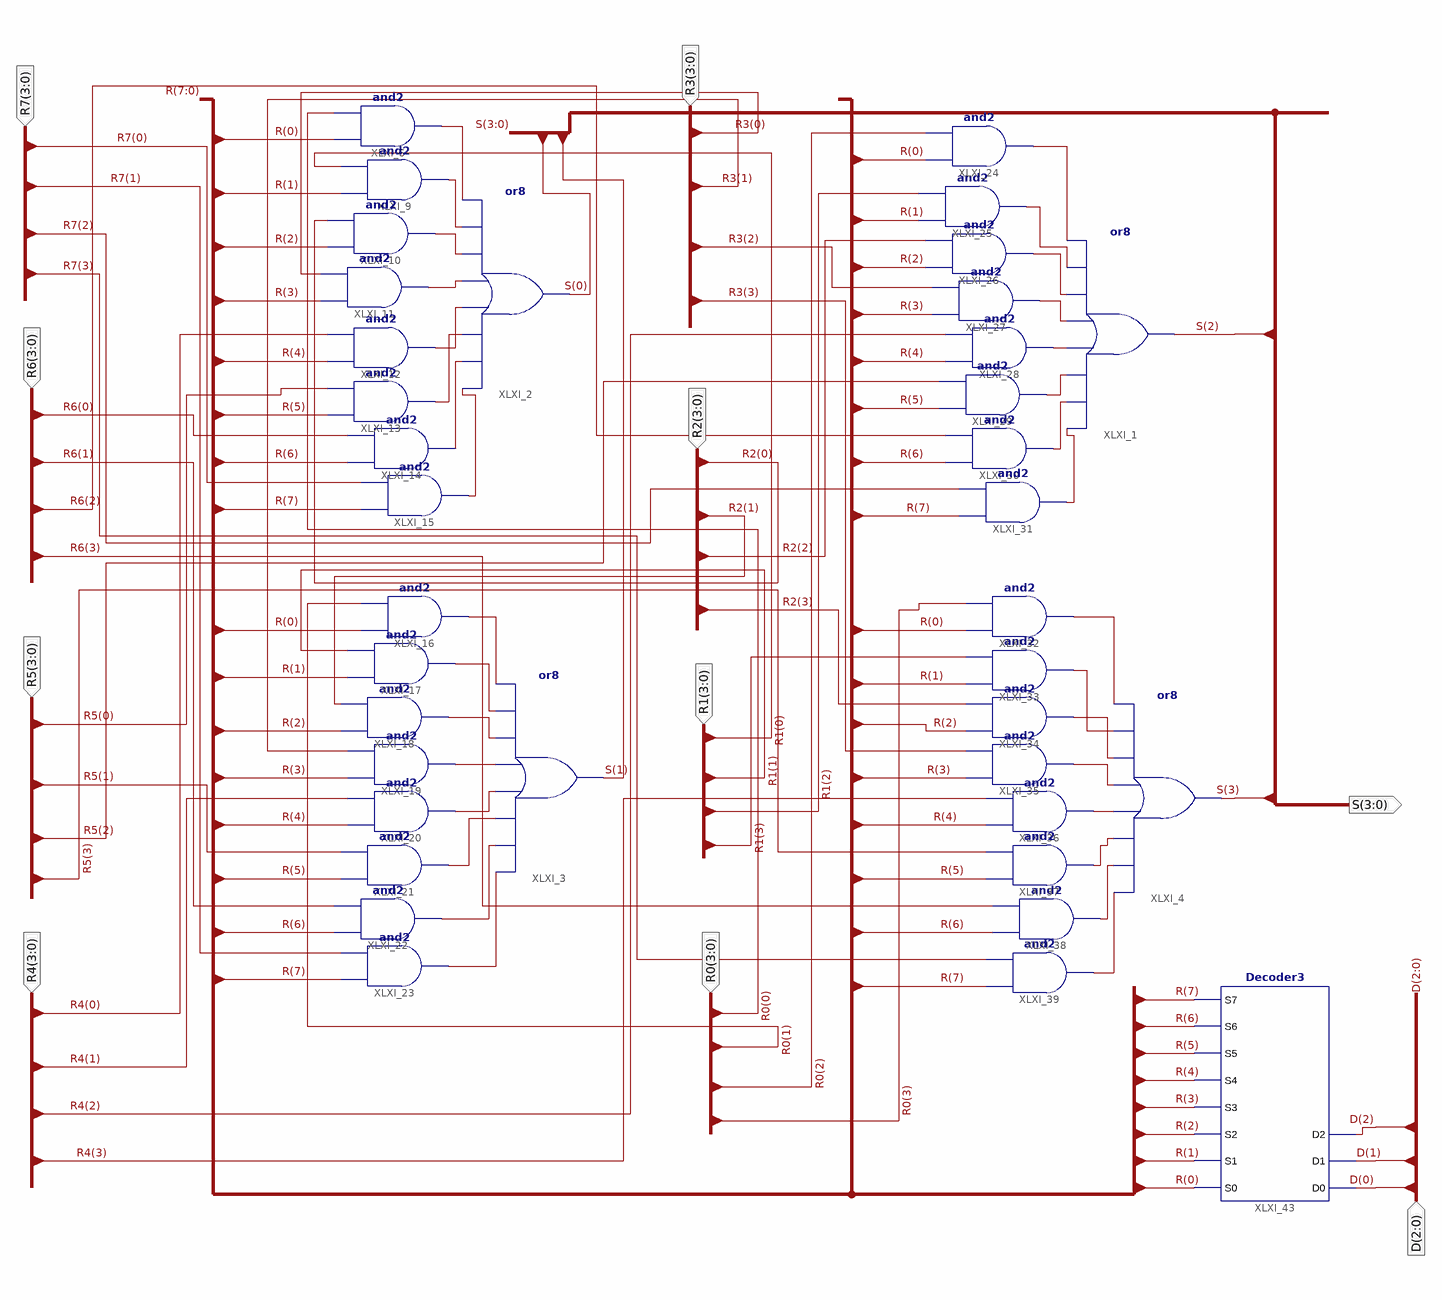
[diagram p0: schematic sheet 1]
// Xilinx ISE schematic MUX_8_4.sch (spartan3e) as structural Verilog: 37 symbols, 10 ports
module MUX_8_4 (
  input  [3:0] R7,
  input  [3:0] R4,
  input  [3:0] R3,
  input  [3:0] R2,
  input  [3:0] R1,
  input  [3:0] R0,
  input  [3:0] R6,
  input  [3:0] R5,
  input  [2:0] D,
  output [3:0] S
);

  wire XLXN_1, XLXN_2, XLXN_3, XLXN_4, XLXN_5, XLXN_6, XLXN_7, XLXN_8, XLXN_9, XLXN_10, XLXN_11, XLXN_12,
       XLXN_13, XLXN_15, XLXN_16, XLXN_17, XLXN_18, XLXN_20, XLXN_21, XLXN_23, XLXN_24, XLXN_25, XLXN_26,
       XLXN_27, XLXN_29, XLXN_30, XLXN_31, XLXN_32, XLXN_33, XLXN_75, XLXN_76, XLXN_77;
  wire [7:0] R;

  or XLXI_1 (S[2], XLXN_25, XLXN_24, XLXN_23, XLXN_21, XLXN_20, XLXN_18, XLXN_76, XLXN_17);
  or XLXI_2 (S[0], XLXN_8, XLXN_7, XLXN_6, XLXN_5, XLXN_4, XLXN_3, XLXN_2, XLXN_1);
  or XLXI_3 (S[1], XLXN_16, XLXN_15, XLXN_75, XLXN_13, XLXN_12, XLXN_11, XLXN_10, XLXN_9);
  or XLXI_4 (S[3], XLXN_33, XLXN_32, XLXN_31, XLXN_30, XLXN_29, XLXN_27, XLXN_77, XLXN_26);
  and XLXI_6 (XLXN_1, R[0], R0[0]);
  and XLXI_9 (XLXN_2, R[1], R1[0]);
  and XLXI_10 (XLXN_3, R[2], R2[0]);
  and XLXI_11 (XLXN_4, R[3], R3[0]);
  and XLXI_12 (XLXN_5, R[4], R4[0]);
  and XLXI_13 (XLXN_6, R[5], R5[0]);
  and XLXI_14 (XLXN_7, R[6], R6[0]);
  and XLXI_15 (XLXN_8, R[7], R7[0]);
  and XLXI_16 (XLXN_9, R[0], R0[1]);
  and XLXI_17 (XLXN_10, R[1], R1[1]);
  and XLXI_18 (XLXN_11, R[2], R2[1]);
  and XLXI_19 (XLXN_12, R[3], R3[1]);
  and XLXI_20 (XLXN_13, R[4], R4[1]);
  and XLXI_21 (XLXN_75, R[5], R5[1]);
  and XLXI_22 (XLXN_15, R[6], R6[1]);
  and XLXI_23 (XLXN_16, R[7], R7[1]);
  and XLXI_25 (XLXN_76, R[1], R1[2]);
  and XLXI_26 (XLXN_18, R[2], R2[2]);
  and XLXI_27 (XLXN_20, R[3], R3[2]);
  and XLXI_28 (XLXN_21, R[4], R4[2]);
  and XLXI_29 (XLXN_23, R[5], R5[2]);
  and XLXI_30 (XLXN_24, R[6], R6[2]);
  and XLXI_31 (XLXN_25, R[7], R7[2]);
  and XLXI_32 (XLXN_26, R[0], R0[3]);
  and XLXI_33 (XLXN_77, R[1], R1[3]);
  and XLXI_34 (XLXN_27, R[2], R2[3]);
  and XLXI_35 (XLXN_29, R[3], R3[3]);
  and XLXI_36 (XLXN_30, R[4], R4[3]);
  and XLXI_37 (XLXN_31, R[5], R5[3]);
  and XLXI_38 (XLXN_32, R[6], R6[3]);
  and XLXI_39 (XLXN_33, R[7], R7[3]);
  Decoder3 XLXI_43 (
    .D0(D[0]), .D1(D[1]), .D2(D[2]), .S0(R[0]), .S1(R[1]), .S2(R[2]), .S3(R[3]), .S4(R[4]), .S5(R[5]),
    .S6(R[6]), .S7(R[7]));
  and XLXI_24 (XLXN_17, R[0], R0[2]);
endmodule
